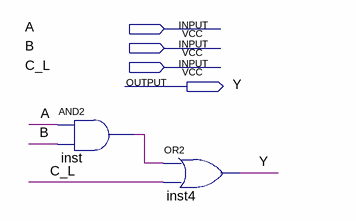
[diagram p0: schematic sheet]
// Quartus schematic ex0.bdf as structural Verilog: 2 symbols, 4 pins
module ex0 (
  input  A,
  input  B,
  input  C_L,
  output Y
);

  wire inst_out;

  and inst (inst_out, A, B);
  or inst4 (Y, inst_out, C_L);
endmodule
